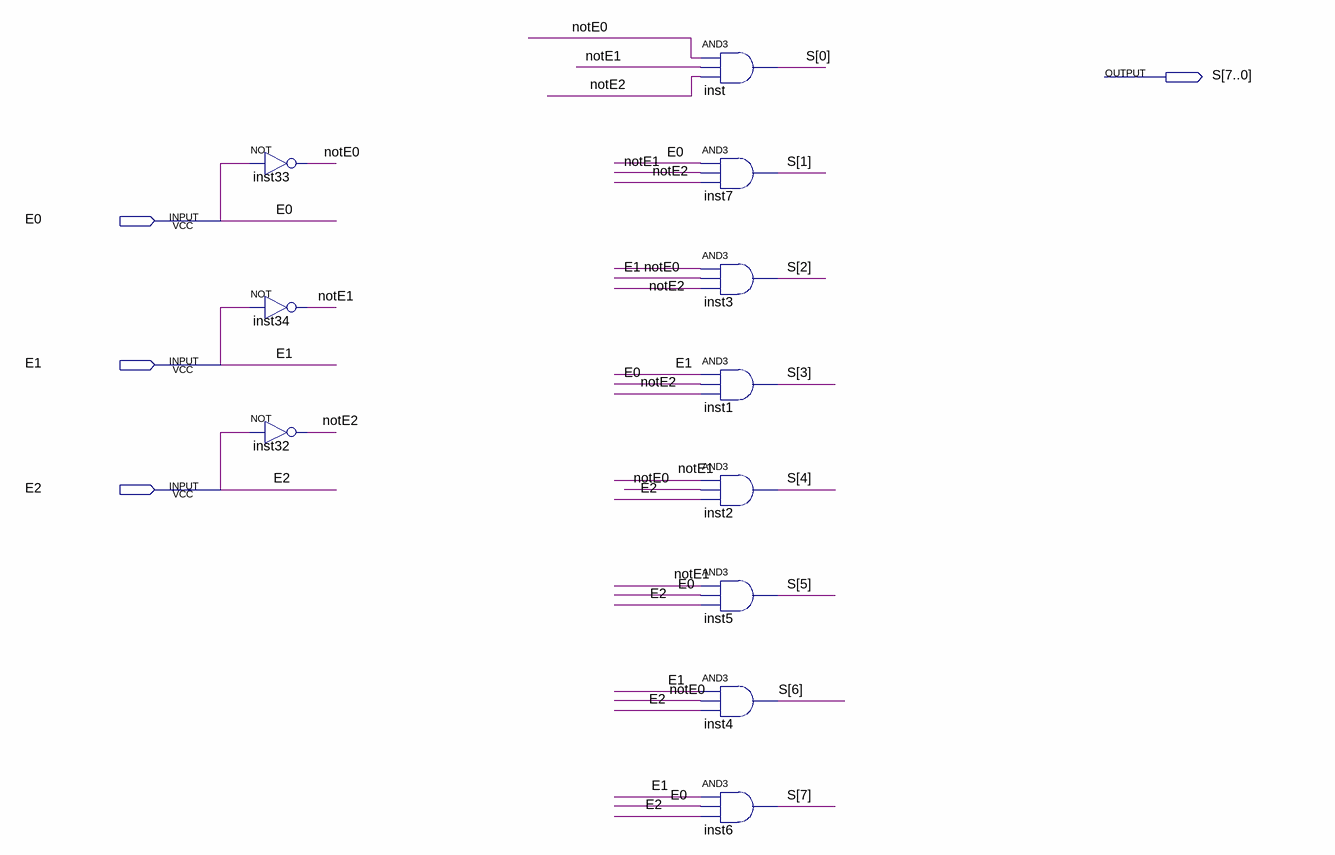
[diagram p0: schematic sheet]
// Quartus schematic DECODER.bdf as structural Verilog: 11 symbols, 4 pins
module DECODER (
  input  E0,
  input  E1,
  input  E2,
  output [7:0] S
);

  wire notE0, notE1, notE2;

  not inst33 (notE0, E0);
  not inst34 (notE1, E1);
  not inst32 (notE2, E2);
  and inst (S[0], notE0, notE1, notE2);
  and inst7 (S[1], E0, notE1, notE2);
  and inst3 (S[2], notE0, E1, notE2);
  and inst1 (S[3], E1, E0, notE2);
  and inst2 (S[4], notE1, notE0, E2);
  and inst5 (S[5], notE1, E0, E2);
  and inst4 (S[6], E1, notE0, E2);
  and inst6 (S[7], E1, E0, E2);
endmodule
